# EAGLE design hv3layerSW (EAGLE 6.6.0)
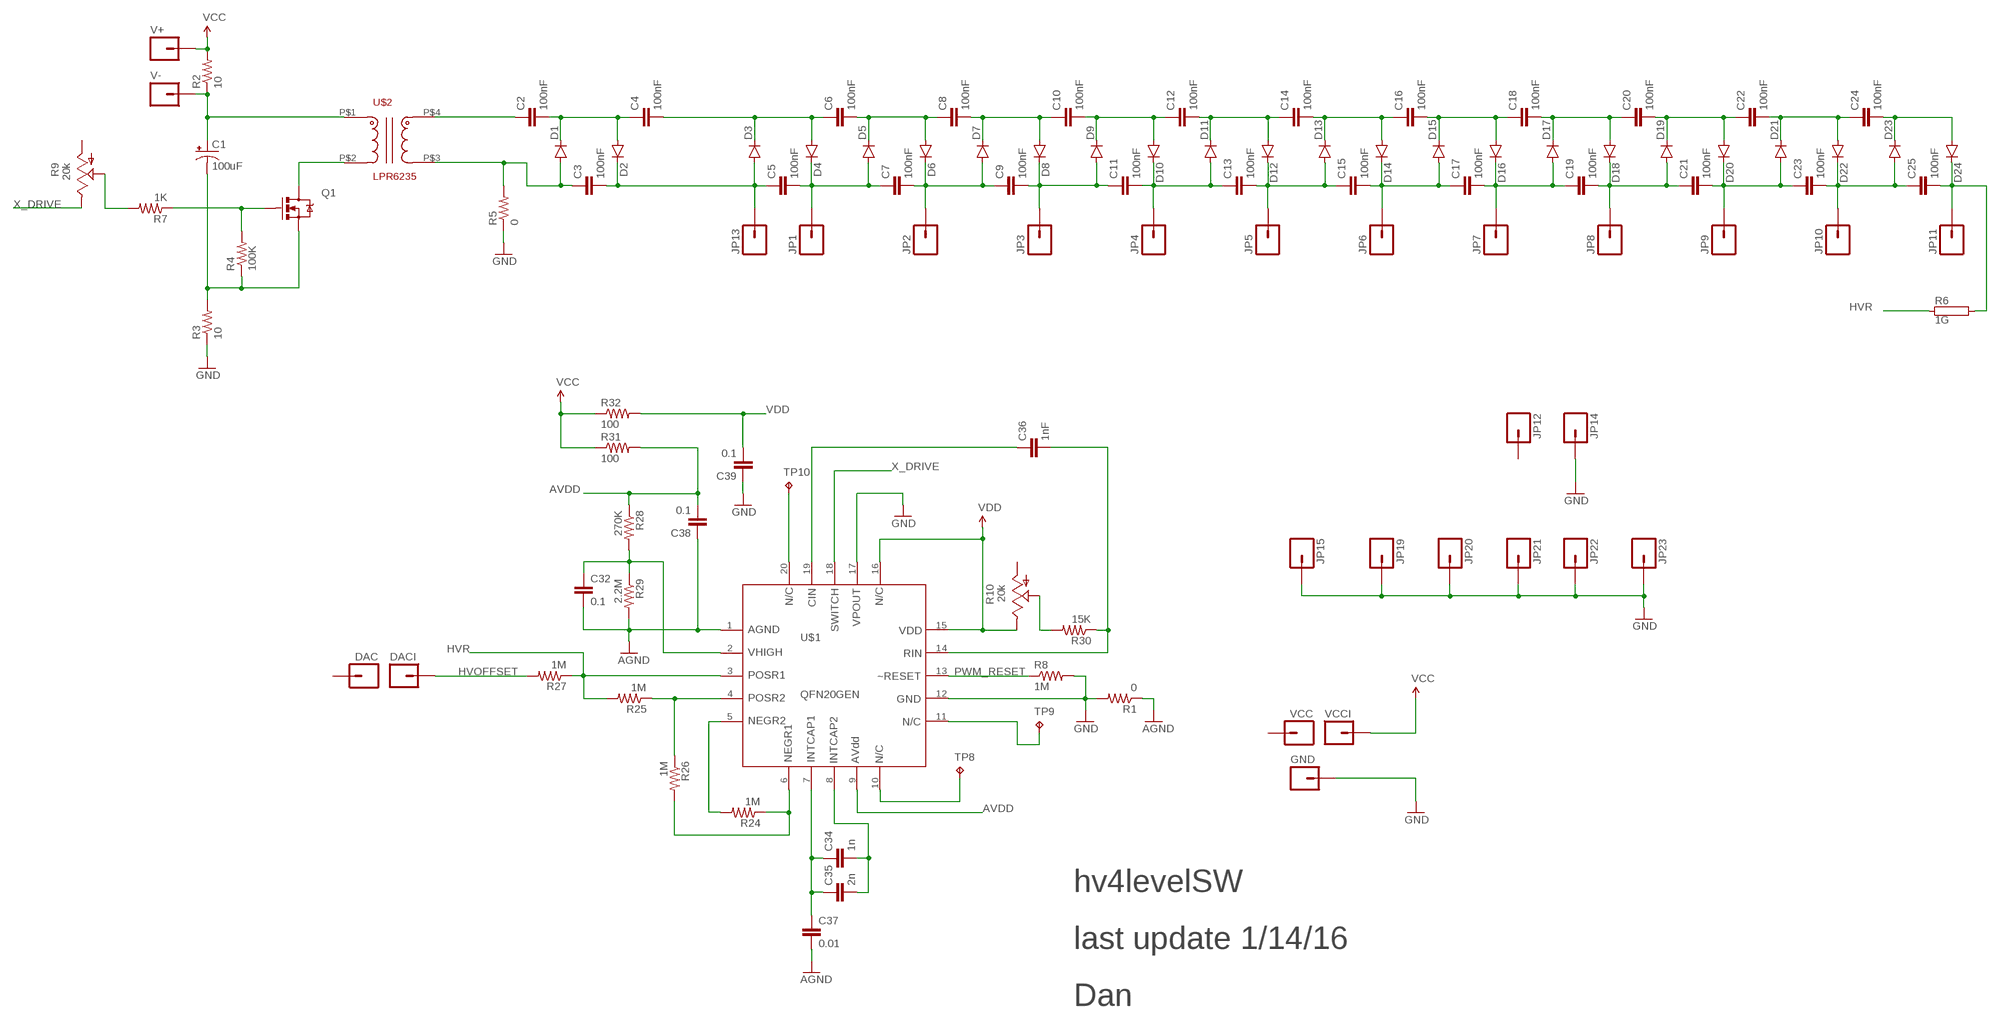
[diagram p0: schematic, sheet 1]

## Parts
C1  100uF  CAP_POL6032  [EIA6032]
C2  100nF  CAP1210  [1210]
C3  100nF  CAP1210  [1210]
C4  100nF  CAP1210  [1210]
C5  100nF  CAP1210  [1210]
C6  100nF  CAP1210  [1210]
C7  100nF  CAP1210  [1210]
C8  100nF  CAP1210  [1210]
C9  100nF  CAP1210  [1210]
C10  100nF  CAP1210  [1210]
C11  100nF  CAP1210  [1210]
C12  100nF  CAP1210  [1210]
C13  100nF  CAP1210  [1210]
C14  100nF  CAP1210  [1210]
C15  100nF  CAP1210  [1210]
C16  100nF  CAP1210  [1210]
C17  100nF  CAP1210  [1210]
C18  100nF  CAP1210  [1210]
C19  100nF  CAP1210  [1210]
C20  100nF  CAP1210  [1210]
C21  100nF  CAP1210  [1210]
C22  100nF  CAP1210  [1210]
C23  100nF  CAP1210  [1210]
C24  100nF  CAP1210  [1210]
C25  100nF  CAP1210  [1210]
C32  0.1  22UF-6.3V-20%(0805)  [0805]
C34  1n  22UF-6.3V-20%(0805)  [0805]
C35  2n  22UF-6.3V-20%(0805)  [0805]
C36  1nF  22UF-6.3V-20%(0805)  [0805]
C37  0.01  22UF-6.3V-20%(0805)  [0805]
C38  0.1  22UF-6.3V-20%(0805)  [0805]
C39  0.1  22UF-6.3V-20%(0805)  [0805]
D1  DIODESOT23  [SOT23-3]
D2  DIODESOT23  [SOT23-3]
D3  DIODESOT23  [SOT23-3]
D4  DIODESOT23  [SOT23-3]
D5  DIODESOT23  [SOT23-3]
D6  DIODESOT23  [SOT23-3]
D7  DIODESOT23  [SOT23-3]
D8  DIODESOT23  [SOT23-3]
D9  DIODESOT23  [SOT23-3]
D10  DIODESOT23  [SOT23-3]
D11  DIODESOT23  [SOT23-3]
D12  DIODESOT23  [SOT23-3]
D13  DIODESOT23  [SOT23-3]
D14  DIODESOT23  [SOT23-3]
D15  DIODESOT23  [SOT23-3]
D16  DIODESOT23  [SOT23-3]
D17  DIODESOT23  [SOT23-3]
D18  DIODESOT23  [SOT23-3]
D19  DIODESOT23  [SOT23-3]
D20  DIODESOT23  [SOT23-3]
D21  DIODESOT23  [SOT23-3]
D22  DIODESOT23  [SOT23-3]
D23  DIODESOT23  [SOT23-3]
D24  DIODESOT23  [SOT23-3]
DAC  M01PTH  [1X01]
DACI  M01PTH  [1X01]
GND  M01PTH  [1X01]
JP1  M01PTH  [1X01]
JP2  M01PTH  [1X01]
JP3  M01PTH  [1X01]
JP4  M01PTH  [1X01]
JP5  M01PTH  [1X01]
JP6  M01PTH  [1X01]
JP7  M01PTH  [1X01]
JP8  M01PTH  [1X01]
JP9  M01PTH  [1X01]
JP10  M01PTH  [1X01]
JP11  M01PTH  [1X01]
JP12  M01PTH  [1X01]
JP13  M01PTH  [1X01]
JP14  M01PTH  [1X01]
JP15  M01PTH  [1X01]
JP19  M01PTH  [1X01]
JP20  M01PTH  [1X01]
JP21  M01PTH  [1X01]
JP22  M01PTH  [1X01]
JP23  M01PTH  [1X01]
Q1  MOSFET-NCHANNELAO3404A  [SOT23-3]
R1  0  RESISTOR0805-RES  [0805]
R2  10  RESISTOR2512  [R2512]
R3  10  RESISTOR2512  [R2512]
R4  100K  RESISTOR0805-RES  [0805]
R5  0  RESISTOR0805-RES  [0805]
R6  1G  RCA4090  [CA4090]
R7  1K  RESISTOR0805-RES  [0805]
R8  1M  RESISTOR0805-RES  [0805]
R9  20k  TRIM_US-3223J  [3223J]
R10  20k  TRIM_US-3223J  [3223J]
R24  1M  RESISTOR0805-RES  [0805]
R25  1M  RESISTOR0805-RES  [0805]
R26  1M  RESISTOR0805-RES  [0805]
R27  1M  RESISTOR0805-RES  [0805]
R28  270K  RESISTOR0805-RES  [0805]
R29  2.2M  RESISTOR0805-RES  [0805]
R30  15K  RESISTOR0805-RES  [0805]
R31  100  RESISTOR0805-RES  [0805]
R32  100  RESISTOR0805-RES  [0805]
TP8  TPTP10R  [TP10R]
TP9  TPTP10R  [TP10R]
TP10  TPTP10R  [TP10R]
U$1  QFN20GEN  [QFN20]
U$2  LPR6235  [LPR6235]
V+  M01PTH  [1X01]
V-  M01PTH  [1X01]
VCC  M01PTH  [1X01]
VCCI  M01PTH  [1X01]

## Nets
AGND: C32.2 C37.2 C38.1 R1.1 R29.2 U$1.1
AVDD: C38.2 R28.1 R31.2 U$1.9
GND: C39.1 GND.1 JP14.1 JP15.1 JP19.1 JP20.1 JP21.1 JP22.1 JP23.1 R1.2 R3.1 R5.1 R8.2 U$1.12 U$1.17
HVOFFSET: DACI.1 R27.2
HVR: R6.1 R25.2 R27.1 U$1.3
N$1: C2.1 U$2.P$4
N$2: C1.P$2(-) Q1.2(S) R3.2 R4.1
N$3: C3.1 D1.1(A) R5.2 U$2.P$3
N$4: Q1.1(G) R4.2 R7.1
N$5: C2.2 C4.1 D1.3(C) D2.1(A)
N$6: R24.1 R26.2 U$1.6
N$7: Q1.3(D) U$2.P$2
N$8: R10.2(S) R30.2
N$9: C3.2 C5.1 D2.3(C) D3.1(A) JP13.1
N$10: C4.2 C6.1 D3.3(C) D4.1(A)
N$11: C5.2 C7.1 D4.3(C) D5.1(A) JP1.1
N$12: C6.2 C8.1 D5.3(C) D6.1(A)
N$13: C7.2 C9.1 D6.3(C) D7.1(A) JP2.1
N$14: C23.2 C25.1 D22.3(C) D23.1(A) JP10.1
N$15: R24.2 U$1.5
N$16: TP10.TP U$1.20
N$17: TP9.TP U$1.11
N$18: C8.2 C10.1 D7.3(C) D8.1(A)
N$19: TP8.TP U$1.10
N$20: C9.2 C11.1 D8.3(C) D9.1(A) JP3.1
N$21: C1.P$1(+) R2.1 U$2.P$1 V-.1
N$22: C10.2 C12.1 D9.3(C) D10.1(A)
N$23: C11.2 C13.1 D10.3(C) D11.1(A) JP4.1
N$24: C12.2 C14.1 D11.3(C) D12.1(A)
N$25: C14.2 C16.1 D13.3(C) D14.1(A)
N$26: C13.2 C15.1 D12.3(C) D13.1(A) JP5.1
N$27: C15.2 C17.1 D14.3(C) D15.1(A) JP6.1
N$28: C17.2 C19.1 D16.3(C) D17.1(A) JP7.1
N$29: C19.2 C21.1 D18.3(C) D19.1(A) JP8.1
N$30: C16.2 C18.1 D15.3(C) D16.1(A)
N$31: C18.2 C20.1 D17.3(C) D18.1(A)
N$32: C20.2 C22.1 D19.3(C) D20.1(A)
N$33: C21.2 C23.1 D20.3(C) D21.1(A) JP9.1
N$34: C22.2 C24.1 D21.3(C) D22.1(A)
N$35: C24.2 D23.3(C) D24.1(A)
N$36: C25.2 D24.3(C) JP11.1 R6.2
N$37: R7.2 R9.2(S)
N$43: C34.1 C35.1 C37.1 U$1.7
N$49: R25.1 R26.1 U$1.4
N$61: C34.2 C35.2 U$1.8
N$63: C32.1 R28.2 R29.1 U$1.2
N$64: C36.2 R30.1 U$1.14
N$65: C36.1 U$1.19
PWM_RESET: R8.1 U$1.13
VCC: R2.2 R31.1 R32.1 V+.1 VCCI.1
VDD: C39.2 R10.3(E) R32.2 U$1.15 U$1.16
X_DRIVE: R9.3(E) U$1.18
Unconnected: DAC.1 JP12.1 R9.1(A) R10.1(A) VCC.1

## Notes on the sheet
- hv4levelSW
- last update 1/14/16
- Dan

## Library data of the parts
C1 = SparkFun-Capacitors:CAP_POL: Capacitor Polarized These are standard SMD and PTH capacitors. Normally 10uF, 47uF, and 100uF in electrolytic and tantalum varieties. Always verify the external diameter of the through hole cap, it varies with capacity, voltage, and manufacturer. The EIA devices should be standard.
C2-C25 = SparkFun-Capacitors:CAP: Capacitor Standard 0603 ceramic capacitor, and 0.1" leaded capacitor.
C32 C34-C39 = SparkFun-Capacitors:22UF-6.3V-20%(0805): CAP-08402 Ceramic; PROD_ID: CAP-08402; VALUE: 22uF
D1-D24 = SparkFun-DiscreteSemi:DIODE: Diode These are standard reverse protection diodes and small signal diodes. SMA package can handle up to about 1A. SOD-323 can handle about 200mA. What the SOD-323 package when ordering, there are some mfgs out there that are 5-pin packages.
DAC DACI GND JP1-JP15 JP19-JP23 V+ V- VCC VCCI = SparkFun-Connectors:M01: Header 1 Standard 1-pin 0.1" header. Use with straight break away headers (SKU : PRT-00116), right angle break away headers (PRT-00553), swiss pins (PRT-00743), machine pins (PRT-00117), and female headers (PRT-00115).
Q1 = SparkFun-DiscreteSemi:MOSFET-NCHANNEL: Common NMOSFET Parts MFG P/N Store ID Prod ID FDD8780 TRANS-09984 SI7820DN TRANS-11055 FDS6630A IC-08089 2N7002PW TRANS-11151 FQP30N06L COM-10213 TRANS-10060 BSS123LT1G TRANS-08345 BSS138 TRANS-00830 BS170 2N7000; PROD_ID: TRAN-12988
R1 R4 R5 R7 R8 R24-R32 = SparkFun-Passives:RESISTOR: Resistor Basic schematic elements and footprints for 0603, 1206, and PTH resistors.
R2 R3 = SparkFun-Resistors:RESISTOR: Resistor Basic schematic elements and footprints for 0603, 1206, and PTH resistors.
R6 = resistor-power:R: Power Resitor; OC_FARNELL: unknown; OC_NEWARK: unknown
R9 R10 = pot:TRIM_US-: POTENTIOMETER
TP8-TP10 = testpad:TP: Test pad
U$1 = specials:QFN20GEN
U$2 = inductor-coilcraft-2:LPR6235

## Board
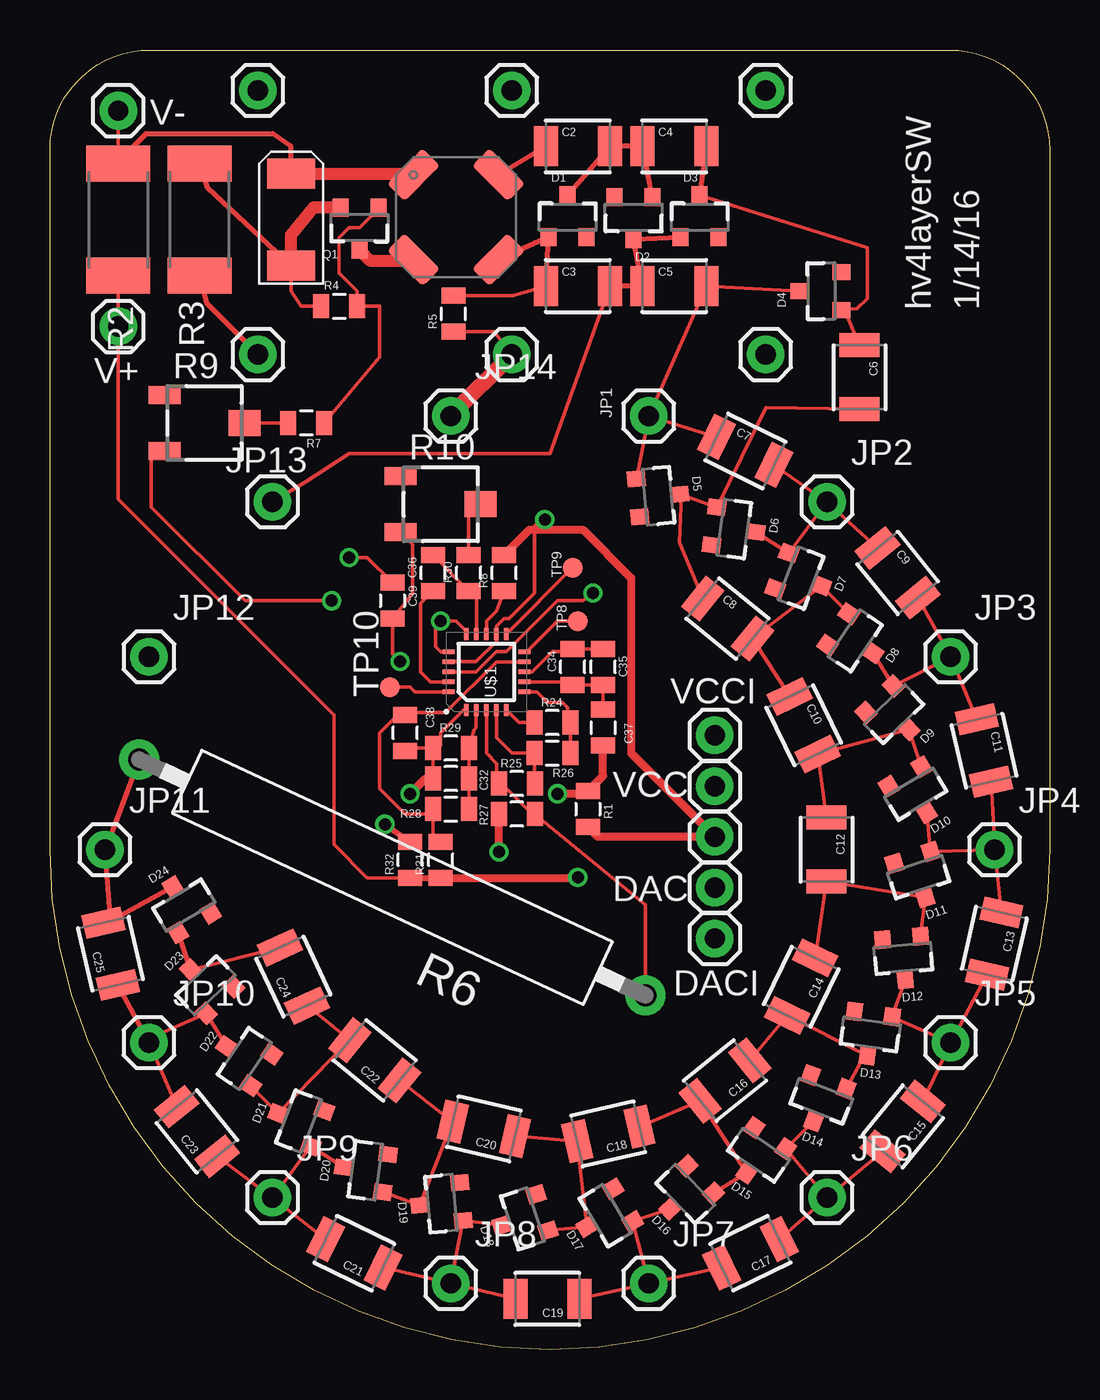
[diagram p1: board, top side]
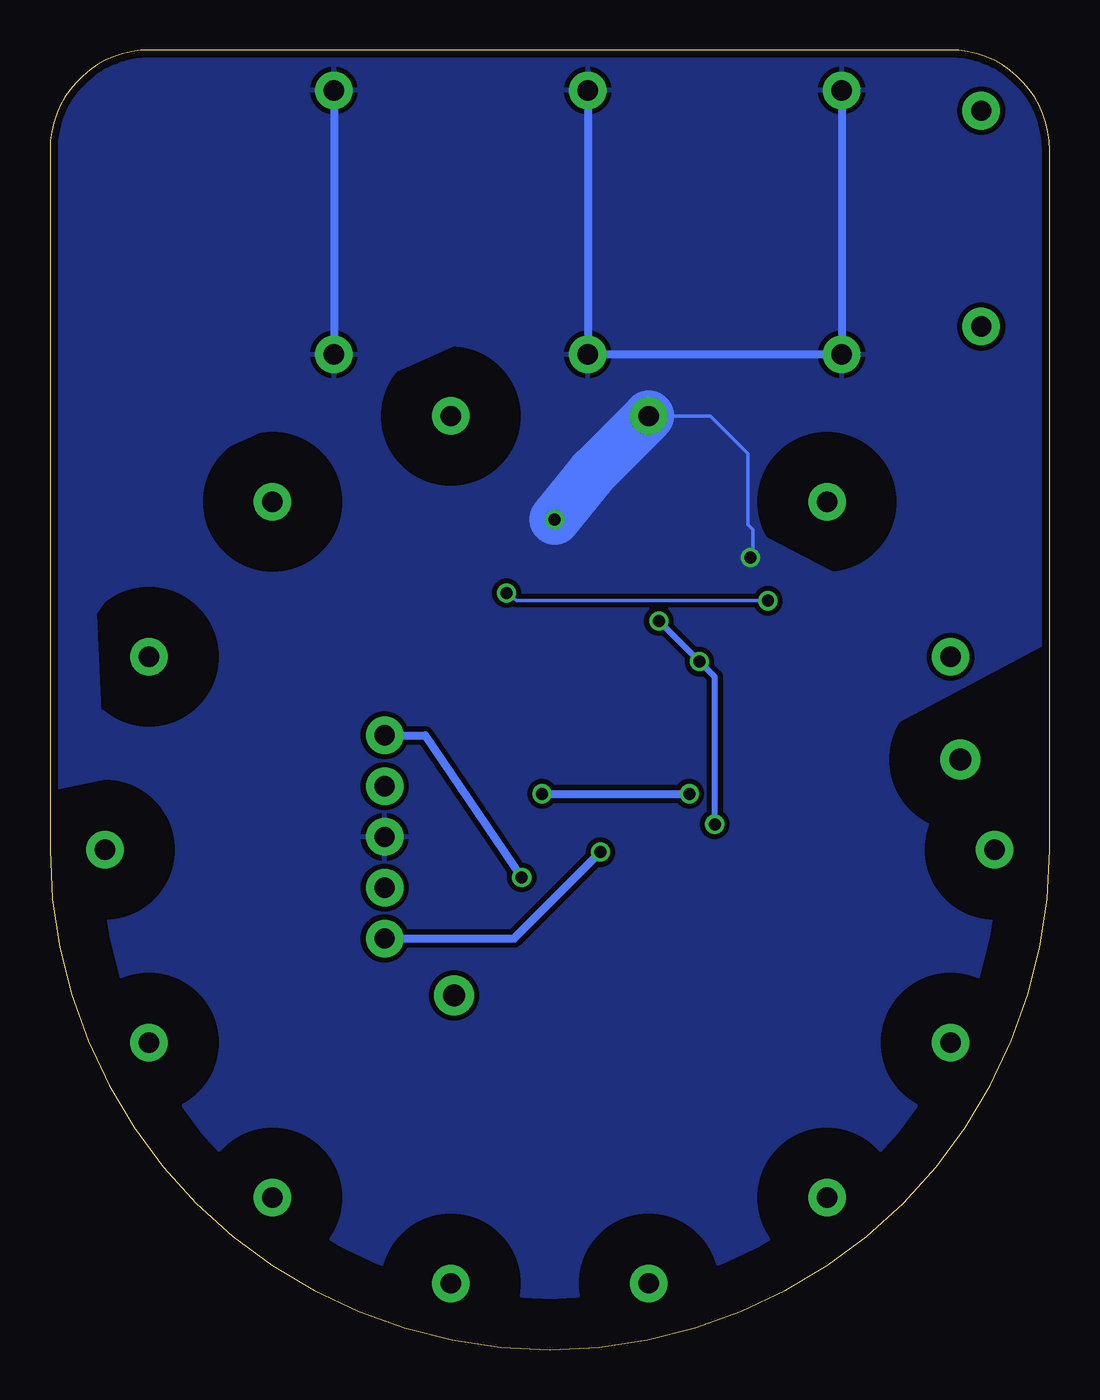
[diagram p2: board, bottom side, seen from below]

Size 50 x 65 mm. Coordinates in mm from the lower left corner, seen from the top.
Outline: 0,25 0,60 arc-90 5,65 45,65 arc-90 50,60 50,25 arc-180 0,25
Copper layers (1*16): Top 0.0356mm / dielectric 1.5011mm / Bottom 0.0356mm
Design rules "oshpark": minimum track width 6mil, minimum drill 13mil, track to track 6mil, track to pad 6mil, pad to pad 6mil, via to via 6mil, smd to smd 6mil, copper to edge 15mil, drill to drill 6mil, minimum pad ring 7mil, minimum via ring 7mil, stop-mask expansion 3mil, vias tented up to drill 0mil, thermal gap 10mil

### Footprints (pad centres in the part's own frame; a part is rotated, then mirrored left to right if it is on the bottom)
EIA6032 = smd 1.5 x 2.4: P$1 -2.3,0; P$2 2.3,0
1210 = smd 1.2 x 2: 1 -1.6,0; 2 1.6,0
0805 = smd 0.8 x 1.2: 1 -0.9,0; 2 0.9,0
SOT23-3 = smd 0.8 x 0.9: 1 -0.95,-1; 2 0.95,-1; 3 0,1.1
1X01 = drill 1.016 pad 1.88: 1 0,0
R2512 = smd 1.8 x 3.2: 1 -2.8,0; 2 2.8,0
CA4090 = drill 1.1 pad 2: 1 -13.97,0; 2 13.97,0
3223J = smd 1.6 x 0.9: 1 -2,1.4; 3 -2,-1.4 | smd 1.6 x 1.3: 2 2,0
TP10R = smd 1 x 1: TP 0,0
QFN20 = smd 0.6 x 0.23: 1 -1.9,1; 2 -1.9,0.5; 3 -1.9,0; 4 -1.9,-0.5; 5 -1.9,-1; 11 1.9,-1; 12 1.9,-0.5; 13 1.9,0; 14 1.9,0.5; 15 1.9,1 | smd 0.23 x 0.6: 6 -1,-1.9; 7 -0.5,-1.9; 8 0,-1.9; 9 0.5,-1.9; 10 1,-1.9; 16 1,1.9; 17 0.5,1.9; 18 0,1.9; 19 -0.5,1.9; 20 -1,1.9
LPR6235 = smd 2.54 x 1.27 rotated 45: P$1 -2.125,2.125; P$3 2.125,-2.125 | smd 2.54 x 1.27 rotated 135: P$2 -2.125,-2.125; P$4 2.125,2.125

### Placement (x,y rotation side)
C1  12.05,56.5 270 top
C2  26.4,60.18 0 top
C3  26.4,53.2 0 top
C4  31.23,60.18 0 top
C5  31.23,53.2 0 top
C6  40.5,48.63 270 top
C7  34.78,44.94 334 top
C8  33.9,36.56 321 top
C9  42.4,38.85 309 top
C10  37.7,31.23 296 top
C11  46.72,29.96 283 top
C12  38.85,25.01 270 top
C13  47.23,20.31 257 top
C14  37.58,18.15 244 top
C15  42.66,11.16 231 top
C16  33.77,13.45 219 top
C17  35.04,4.81 206 top
C18  27.93,10.78 193 top
C19  24.88,2.53 180 top
C20  21.7,11.04 167 top
C21  15.23,4.81 154 top
C22  16.24,14.46 141 top
C23  7.35,10.91 129 top
C24  12.18,18.66 115 top
C25  3.03,19.8 103 top
C32  20.05,28.56 180 top
C34  26.15,34.15 90 top
C35  27.67,34.15 90 top
C36  19.16,38.85 90 top
C37  27.67,31.1 270 top
C38  17.77,30.85 90 top
C39  17.13,37.45 270 top
D1  25.89,56.63 0 top
D2  29.2,56.63 180 top
D3  32.5,56.63 0 top
D4  38.59,52.94 90 top
D5  30.41,42.69 275 top
D6  34.21,41.04 262 top
D7  37.55,38.59 249 top
D8  40.26,35.46 236 top
D9  42.2,31.8 224 top
D10  43.29,27.8 211 top
D11  43.45,23.66 198 top
D12  42.69,19.59 185 top
D13  41.04,15.79 172 top
D14  38.59,12.45 159 top
D15  35.46,9.74 146 top
D16  31.8,7.8 134 top
D17  27.8,6.71 121 top
D18  23.66,6.55 108 top
D19  19.59,7.31 95 top
D20  15.79,8.96 82 top
D21  12.45,11.41 69 top
D22  9.74,14.54 56 top
D23  7.8,18.2 44 top
D24  6.71,22.2 31 top
DAC  33.26,23.1 0 top
DACI  33.26,20.56 0 top
GND  33.26,25.64 0 top
JP1  29.95,46.69 0 top
JP2  38.87,42.4 0 top
JP3  45.05,34.65 0 top
JP4  47.25,25 0 top
JP5  45.05,15.35 0 top
JP6  38.87,7.6 0 top
JP7  29.95,3.31 0 top
JP8  20.05,3.31 0 top
JP9  11.13,7.6 0 top
JP10  4.95,15.35 0 top
JP11  2.75,25 0 top
JP12  4.95,34.65 0 top
JP13  11.13,42.4 0 top
JP14  20.05,46.69 0 top
JP15  10.4,62.98 0 top
JP19  23.1,62.98 0 top
JP20  35.8,49.77 0 top
JP21  23.1,49.77 0 top
JP22  10.4,49.77 0 top
JP23  35.8,62.98 0 top
Q1  15.48,56.12 180 top
R1  26.91,27.04 270 top
R2  3.41,56.5 270 top
R3  7.48,56.5 90 top
R4  14.46,52.18 0 top
R5  20.18,51.8 90 top
R6  17.13,23.61 155 top
R7  12.81,46.34 180 top
R8  22.72,38.85 90 top
R9  7.73,46.34 0 top
R10  19.54,42.28 0 top
R24  25.13,31.35 180 top
R25  23.35,28.31 180 top
R26  25.13,29.83 0 top
R27  23.35,26.78 180 top
R28  20.05,27.04 0 top
R29  20.05,30.09 180 top
R30  20.94,38.85 90 top
R31  19.54,24.5 90 top
R32  18.02,24.5 90 top
TP8  26.4,36.44 90 top
TP9  26.15,39.1 90 top
TP10  17,33.13 90 top
U$1  21.83,33.9 90 top
U$2  20.31,56.63 0 top
V+  3.41,51.17 0 top
V-  3.41,61.96 0 top
VCC  33.26,28.18 0 top
VCCI  33.26,30.72 0 top

### Tracks (layer width: path | path; a pad name or v marks a point on that pad's centre or on a via)
AGND  (via drill 0.6)
  Top 0.178: U$1.1 20.69,31.99 19.54,30.85 19.54,30.22 R29.2 | R29.2 17.9,30.09 C38.1 | R29.2 C32.2
  Top 0.406: v25.39,27.8 26.77,27.8 R1.1 27.67,28.7 C37.2 | v18.02,27.8 18.78,28.56 C32.2
  Bottom 0.406: v25.39,27.8 v18.02,27.8
AVDD
  Top 0.178: R31.2 19.15,25.79 19.15,26.78 | 19.15,26.78 R28.1 | U$1.9 22.33,34.4 19.8,31.86 17.88,31.86 C38.2 17.4,31.75 16.5,30.85 16.5,28.05 17.77,26.78 19.15,26.78
GND  (via drill 0.6)
  Top 0.178: U$1.17 21.32,34.4 22.33,35.41 U$1.12 22.34,36.18 22.72,36.56 22.97,36.56 24.24,37.83 24.24,41.01 | R5.1 22.22,50.9 JP21.1 | C39.1 15.87,39.61 v14.97,39.61
  Top 0.254: JP22.1 7.86,52.31 R3.1
  Top 0.406: R1.2 27.41,25.64 GND.1 29.07,29.83 29.07,38.59 26.66,41.01 24.24,41.01 | R8.2 23.98,41.01 24.24,41.01 | 24.24,41.01 v24.75,41.52
  Top 0.813: JP14.1 20.05,46.72 JP21.1
  Bottom 0.178: v14.97,39.61 14.84,39.74 14.84,41.01 15.1,41.26 15.1,44.82 16.97,46.69 JP14.1
  Bottom 0.406: JP15.1 JP22.1 JP21.1 JP19.1 | JP23.1 JP20.1
  Bottom 2.54: v24.75,41.52 22.85,43.89 JP14.1
  pour Bottom (isolate 0.254): -0.39,35.67 9.64,30.34 9.13,20.81 12.43,11.67 20.94,8.62 29.45,6.84 38.09,14.59 41.64,19.8 41.9,27.04 40.12,35.8 35.67,39.99 30.59,41.01 20.43,43.8 10.4,38.59 3.29,42.15 7.86,46.59 23.73,46.72 27.8,51.17 42.28,44.69 47.74,36.82 47.36,28.56 49.77,28.05 50.41,29.58 50.79,65.52 -0.01,65.26
  pour Bottom (isolate 2.54): -0.14,52.56 50.41,52.31 50.41,0.11 0.37,0.11
HVOFFSET  (via drill 0.6)
  Top 0.406: v22.47,24.88 22.45,24.89 R27.2
  Bottom 0.406: DACI.1 26.78,20.56 v22.47,24.88
HVR
  Top 0.178: U$1.3 21.83,29.83 22.34,29.32 22.34,28.42 R25.2 22.59,28.31 23.86,27.04 24,27.04 R27.1 29.79,22.25 R6.1
N$1
  Top 0.254: U$2.P$4 C2.1
N$2
  Top 0.178: R4.1 12.56,52.18 12.05,52.94 C1.P$2
  Top 0.254: R3.2 7.86,58.14 C1.P$2
  Top 0.61: Q1.2 13.18,57.12 12.05,55.74 C1.P$2
N$3
  Top 0.178: R5.2 23.16,52.7 C3.1
  Top 0.254: U$2.P$3 D1.1 C3.1
N$4
  Top 0.178: Q1.1 16.43,57.07 15.48,56.12 14.97,56.12 14.46,55.61 14.46,53.83 15.36,52.93 R4.2 16.5,52.18 16.5,49.64 R7.1
N$5
  Top 0.254: D1.3 C2.2 C4.1 D2.1
N$6
  Top 0.178: U$1.6 24.35,32.9 24.88,32.37 25.64,32.37 25.89,32.12 25.89,31.49 R24.1 R26.2
N$7
  Top 0.61: Q1.3 15.48,54.98 15.99,54.47 18.15,54.47 U$2.P$2
N$8
  Top 0.178: R30.2 20.94,41.67 R10.2
N$9
  Top 0.178: JP13.1 12.81,43.42 14.97,44.82 25.01,44.82 C3.2
  Top 0.254: D3.1 D2.3 C5.1 C3.2
N$10
  Top 0.178: D3.3 40.88,55.1 40.88,52.56 40.37,52.06 39.74,52.01 | 39.74,52.01 D4.1 | C6.1 39.74,52.01
  Top 0.254: C4.2 D3.3
N$11
  Top 0.178: D4.3 C5.2 JP1.1 | C7.1 JP1.1 | D5.1 JP1.1
N$12
  Top 0.178: D5.3 31.6,42.75 | 31.6,42.75 D6.1 35.8,47.1 C6.2 | C8.1 31.48,40.37 31.6,42.75
N$13
  Top 0.178: C9.1 JP2.1 | JP2.1 D7.1 D6.3 | C7.2 JP2.1
N$14
  Top 0.178: 4.86,15.51 D23.1 D22.3 | C23.2 JP10.1
  Top 0.254: JP10.1 4.86,15.51 C25.1
N$15
  Top 0.178: R24.2 23.47,31.35 U$1.5
N$16
  Top 0.178: U$1.20 18.26,32.9 18.02,33.13 TP10.TP
N$17
  Top 0.178: TP9.TP 26.14,39.1 U$1.11
N$18
  Top 0.178: C10.1 C8.2 D7.3 D8.1
N$19
  Top 0.178: TP8.TP 25.39,36.44 23.86,34.91 23.75,34.91 U$1.10
N$20
  Top 0.178: C11.1 JP3.1 | JP3.1 D9.1 D8.3 | C9.2 JP3.1
N$21
  Top 0.178: R2.1 V-.1
  Top 0.254: R2.1 3.42,59.43 4.81,60.82 11.16,60.82 12.05,60.18 C1.P$1
  Top 0.61: C1.P$1 18.13,58.8 U$2.P$1
N$22
  Top 0.178: C12.1 C10.2 D9.3 D10.1
N$23
  Top 0.178: C13.1 JP4.1 | JP4.1 D11.1 D10.3 | C11.2 JP4.1
N$24
  Top 0.178: D12.1 D11.3 C12.2 C14.1
N$25
  Top 0.178: C16.1 C14.2 40.77,14.76 | D13.3 40.77,14.76 | D14.1 40.77,14.76
N$26
  Top 0.178: JP5.1 C15.1 | JP5.1 D13.1 D12.3 | C13.2 JP5.1
N$27
  Top 0.178: D14.3 D15.1 JP6.1 | C17.1 JP6.1 | JP6.1 C15.2
N$28
  Top 0.178: C19.1 JP7.1 | JP7.1 D17.1 D16.3 | C17.2 JP7.1
N$29
  Top 0.178: C21.1 JP8.1 | JP8.1 D19.1 D18.3 | C19.2 JP8.1
N$30
  Top 0.178: C18.1 C16.2 D15.3 D16.1
N$31
  Top 0.178: C20.1 C18.2 D17.3 D18.1
N$32
  Top 0.178: C22.1 C20.2 D19.3 D20.1
N$33
  Top 0.178: 11.07,7.65 JP9.1 D21.1 D20.3 | 11.07,7.65 C23.1 | C21.2 11.07,7.65
N$34
  Top 0.178: C22.2 14.98,15.49 | 14.98,15.49 C24.1 | 14.98,15.49 D21.3 D22.1
N$35
  Top 0.178: C24.2 D23.3
  Top 0.254: D23.3 D24.1
N$36
  Top 0.254: R6.2 JP11.1 3.03,21.45 | C25.2 3.03,21.45 | D24.3 3.03,21.45
N$37
  Top 0.178: R9.2 R7.2
N$43
  Top 0.178: U$1.7 25.12,33.4 25.13,33.39 26.01,33.39 C34.1 C35.1 C37.1
N$49
  Top 0.178: U$1.4 22.33,30.6 23.1,29.83 R26.1 24.23,28.33 R25.1
N$61
  Top 0.178: U$1.8 24.12,33.9 25.13,34.91 26.01,34.91 C34.2 C35.2
N$63
  Top 0.178: R28.2 C32.1 R29.1 21.21,30.98 21.32,31.1 21.32,31.99 U$1.2
N$64
  Top 0.178: U$1.14 21.33,37.95 R30.1 19.16,39.73 C36.2
N$65
  Top 0.178: U$1.19 19.92,33.39 19.04,33.39 18.53,33.9 18.53,37.31 C36.1
PWM_RESET
  Top 0.178: U$1.13 21.83,36.44 22.34,36.94 R8.1
VCC  (via drill 0.6)
  Top 0.178: R32.1 15.87,23.6 14.21,25.26 14.21,31.74 3.41,42.53 V+.1 R2.2
  Top 0.305: R32.1 R31.1
  Top 0.406: R31.1 26.39,23.6 v26.4,23.61
  Bottom 0.406: VCCI.1 31.23,30.72 v26.4,23.61
VDD  (via drill 0.6)
  Top 0.178: U$1.15 20.83,35.91 20.31,36.44 v19.54,36.44 19.29,36.18 19.29,35.16 19.56,34.9 U$1.16 | v17.51,34.4 17.13,34.78 C39.2 18.14,37.82 18.15,37.83 18.15,40.27 R10.3
  Top 0.305: v16.75,26.27 R32.2
  Bottom 0.305: v16.75,26.27 16.75,33.64 v17.51,34.4 v19.54,36.44
X_DRIVE  (via drill 0.6)
  Top 0.178: U$1.18 21.32,33.9 22.34,34.91 22.85,34.91 25.39,37.45 26.66,37.45 v27.16,37.83 | v14.08,37.45 9.77,37.45 5.07,42.15 5.07,44.82 5.61,44.82 R9.3
  Bottom 0.178: v14.08,37.45 26.66,37.45 v27.16,37.83

### Text on the board
tPlace: hv4layerSW | 1/14/16